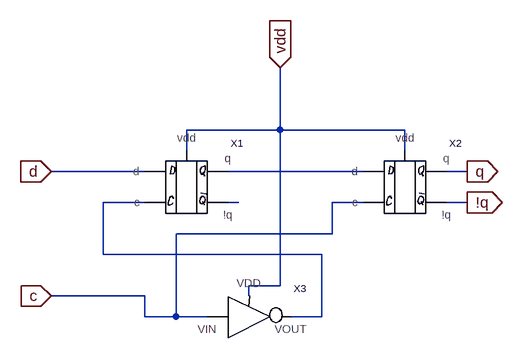
[diagram p0: schematic d-front.asc]
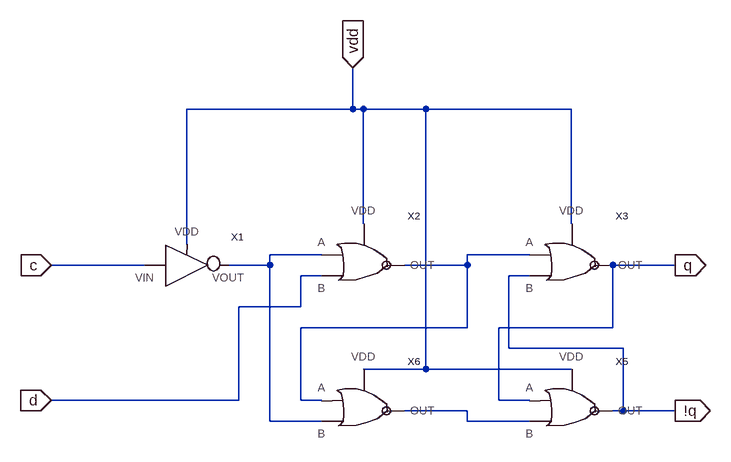
[diagram p1: sub-circuit d-level.asc]
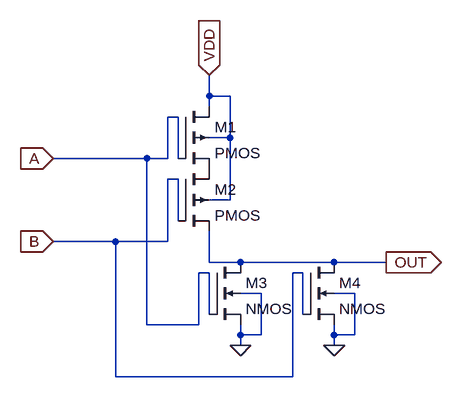
[diagram p2: sub-circuit nor.asc]
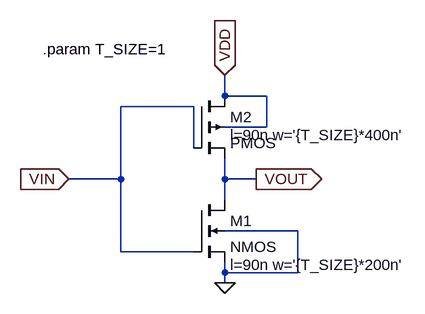
[diagram p3: sub-circuit inverter.asc]
d-front.asc, the LTspice schematic file:
Version 4
SHEET 1 880 680
WIRE 240 64 240 -32
WIRE 240 64 96 64
WIRE 432 64 240 64
WIRE 96 96 96 64
WIRE 432 96 432 64
WIRE 32 128 -112 128
WIRE 368 128 160 128
WIRE 528 128 496 128
WIRE 32 176 -32 176
WIRE 176 176 160 176
WIRE 368 176 320 176
WIRE 528 176 496 176
WIRE 320 224 320 176
WIRE 320 224 80 224
WIRE -32 256 -32 176
WIRE 304 256 -32 256
WIRE 240 304 240 64
WIRE 240 304 192 304
WIRE 32 320 -112 320
WIRE 192 320 192 304
WIRE 32 352 32 320
WIRE 80 352 80 224
WIRE 80 352 32 352
WIRE 128 352 80 352
WIRE 304 352 304 256
WIRE 304 352 256 352
FLAG -112 128 d
IOPIN -112 128 In
FLAG -112 320 c
IOPIN -112 320 In
FLAG 528 128 q
IOPIN 528 128 Out
FLAG 528 176 !q
IOPIN 528 176 Out
FLAG 240 -32 vdd
IOPIN 240 -32 In
SYMBOL d-level 96 160 R0
SYMATTR InstName X1
SYMBOL d-level 432 160 R0
SYMATTR InstName X2
SYMBOL inverter 192 352 R0
SYMATTR InstName X3

d-level.asc, the sub-circuit schematic file:
Version 4
SHEET 1 928 680
WIRE 352 -112 352 -176
WIRE 352 -112 96 -112
WIRE 368 -112 352 -112
WIRE 464 -112 368 -112
WIRE 688 -112 464 -112
WIRE 368 64 368 -112
WIRE 688 64 688 -112
WIRE 96 96 96 -112
WIRE 304 112 224 112
WIRE 624 112 528 112
WIRE 32 128 -112 128
WIRE 224 128 224 112
WIRE 224 128 160 128
WIRE 528 128 528 112
WIRE 528 128 432 128
WIRE 848 128 752 128
WIRE 304 144 272 144
WIRE 624 144 592 144
WIRE 272 192 272 144
WIRE 272 192 176 192
WIRE 528 224 528 128
WIRE 528 224 272 224
WIRE 752 224 752 128
WIRE 752 224 576 224
WIRE 592 256 592 144
WIRE 768 256 592 256
WIRE 464 288 464 -112
WIRE 464 288 368 288
WIRE 688 288 464 288
WIRE 176 336 176 192
WIRE 176 336 -112 336
WIRE 272 336 272 224
WIRE 304 336 272 336
WIRE 576 336 576 224
WIRE 624 336 576 336
WIRE 528 352 432 352
WIRE 768 352 768 256
WIRE 768 352 752 352
WIRE 848 352 768 352
WIRE 224 368 224 128
WIRE 304 368 224 368
WIRE 528 368 528 352
WIRE 624 368 528 368
FLAG -112 336 d
IOPIN -112 336 In
FLAG -112 128 c
IOPIN -112 128 In
FLAG 848 128 q
IOPIN 848 128 Out
FLAG 848 352 !q
IOPIN 848 352 Out
FLAG 352 -176 vdd
IOPIN 352 -176 In
SYMBOL nor 368 128 R0
SYMATTR InstName X2
SYMBOL nor 688 128 R0
SYMATTR InstName X3
SYMBOL nor 688 352 R0
SYMATTR InstName X5
SYMBOL nor 368 352 R0
SYMATTR InstName X6
SYMBOL inverter 96 128 R0
SYMATTR InstName X1

nor.asc, the sub-circuit schematic file:
Version 4
SHEET 1 880 680
WIRE 352 0 352 -32
WIRE 384 0 352 0
WIRE 352 16 352 0
WIRE 304 32 288 32
WIRE 384 64 384 0
WIRE 384 64 352 64
WIRE 256 96 112 96
WIRE 288 96 288 32
WIRE 288 96 256 96
WIRE 304 96 304 32
WIRE 304 128 288 128
WIRE 384 160 384 64
WIRE 384 160 352 160
WIRE 304 192 304 128
WIRE 208 224 112 224
WIRE 288 224 288 128
WIRE 288 224 208 224
WIRE 352 256 352 208
WIRE 400 256 352 256
WIRE 544 256 400 256
WIRE 624 256 544 256
WIRE 352 272 336 272
WIRE 496 272 480 272
WIRE 432 304 400 304
WIRE 576 304 544 304
WIRE 352 336 352 272
WIRE 496 336 496 272
WIRE 256 352 256 96
WIRE 336 352 336 272
WIRE 336 352 256 352
WIRE 400 368 400 352
WIRE 432 368 432 304
WIRE 432 368 400 368
WIRE 544 368 544 352
WIRE 576 368 576 304
WIRE 576 368 544 368
WIRE 400 384 400 368
WIRE 544 384 544 368
WIRE 208 432 208 224
WIRE 480 432 480 272
WIRE 480 432 208 432
FLAG 352 -32 VDD
IOPIN 352 -32 In
FLAG 400 384 0
FLAG 544 384 0
FLAG 624 256 OUT
IOPIN 624 256 Out
FLAG 112 96 A
IOPIN 112 96 In
FLAG 112 224 B
IOPIN 112 224 In
SYMBOL pmos4 304 16 R0
SYMATTR InstName M1
SYMATTR Value2 l=90n w=400n
SYMBOL pmos4 304 112 R0
SYMATTR InstName M2
SYMATTR Value2 l=90n w=400n
SYMBOL nmos4 352 256 R0
SYMATTR InstName M3
SYMATTR Value2 l=90n w=200n
SYMBOL nmos4 496 256 R0
SYMATTR InstName M4
SYMATTR Value2 l=90n w=200n

inverter.asc, the sub-circuit schematic file:
Version 4
SHEET 1 880 680
WIRE 176 -128 176 -160
WIRE 240 -128 176 -128
WIRE 128 -112 16 -112
WIRE 240 -80 240 -128
WIRE 240 -80 176 -80
WIRE 128 -48 128 -112
WIRE 16 0 16 -112
WIRE 16 0 -64 0
WIRE 176 0 176 -32
WIRE 224 0 176 0
WIRE 176 32 176 0
WIRE 288 80 176 80
WIRE 16 112 16 0
WIRE 128 112 16 112
WIRE 176 144 176 128
WIRE 288 144 288 80
WIRE 288 144 176 144
WIRE 176 160 176 144
FLAG 176 160 0
FLAG -64 0 VIN
IOPIN -64 0 In
FLAG 224 0 VOUT
IOPIN 224 0 Out
FLAG 176 -160 VDD
IOPIN 176 -160 In
SYMBOL nmos4 128 32 R0
WINDOW 123 56 100 Left 2
SYMATTR InstName M1
SYMATTR Value2 l=90n w='{T_SIZE}*200n'
SYMBOL pmos4 128 -128 R0
WINDOW 123 56 60 Left 2
SYMATTR InstName M2
SYMATTR Value2 l=90n w='{T_SIZE}*400n'
TEXT -104 -200 Left 2 !.param T_SIZE=1

The netlist it stands for:
* d-front.asc
XX1 d N002 N001 N003 vdd d-level
XX2 N001 c q !q vdd d-level
XX3 c vdd N002 inverter

* block symbol definitions
.subckt d-level d c q !q vdd
XX2 N001 d N002 vdd nor
XX3 N002 !q q vdd nor
XX5 q N003 !q vdd nor
XX6 N002 N001 N003 vdd nor
XX1 c vdd N001 inverter
.ends d-level

.subckt nor A B OUT VDD
M1 VDD A P001 VDD PMOS l=90n w=400n
M2 P001 B OUT VDD PMOS l=90n w=400n
M3 OUT A 0 0 NMOS l=90n w=200n
M4 OUT B 0 0 NMOS l=90n w=200n
.ends nor

.subckt inverter VIN VDD VOUT
M1 VOUT VIN 0 0 NMOS l=90n w='{T_SIZE}*200n'
M2 VDD VIN VOUT VDD PMOS l=90n w='{T_SIZE}*400n'
.param T_SIZE=1
.ends inverter

.model NMOS NMOS
.model PMOS PMOS
.lib standard.mos
.backanno
.end